# EAGLE design 3Ph RC (EAGLE 6.1)

## Sheet 1 of 2
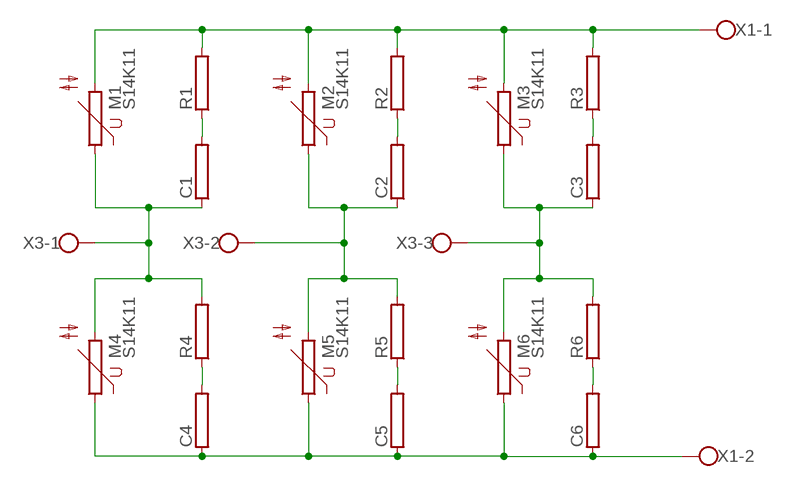
[diagram p0: schematic, sheet 1]

### Parts
C1  RRWM8X34  [RWM8X34]
C2  RRWM8X34  [RWM8X34]
C3  RRWM8X34  [RWM8X34]
C4  RRWM8X34  [RWM8X34]
C5  RRWM8X34  [RWM8X34]
C6  RRWM8X34  [RWM8X34]
M1  S14K11  [S14K11]
M2  S14K11  [S14K11]
M3  S14K11  [S14K11]
M4  S14K11  [S14K11]
M5  S14K11  [S14K11]
M6  S14K11  [S14K11]
R1  RRWM10X45  [RWM10X45]
R2  RRWM10X45  [RWM10X45]
R3  RRWM10X45  [RWM10X45]
R4  RRWM10X45  [RWM10X45]
R5  RRWM10X45  [RWM10X45]
R6  RRWM10X45  [RWM10X45]
X1  W237-102  [W237-102]
X3  W237-103  [W237-103]

### Nets
C1: C1.2 R1.1
N$2: M1.2 M2.2 M3.2 R1.2 R2.2 R3.2 X1.1
N$3: C2.1 M2.1 M5.2 R5.2 X3.2
N$4: C2.2 R2.1
N$5: C3.2 R3.1
N$6: C1.1 M1.1 M4.2 R4.2 X3.1
N$7: C3.1 M3.1 M6.2 R6.2 X3.3
N$9: C6.2 R6.1
N$10: C4.1 C5.1 C6.1 M4.1 M5.1 M6.1 X1.2
N$11: C4.2 R4.1
N$12: C5.2 R5.1

## Sheet 2 of 2

## Library data of the parts
C1-C6 R1-R6 = resistor-power:R: Power Resitor; OC_FARNELL: unknown; OC_NEWARK: unknown
M1-M6 = varistor:S14K11: VARISTOR
X1 = con-wago-500:W237-102: WAGO SCREW CLAMP; MPN: 237-102; OC_FARNELL: unknown; OC_NEWARK: 70K9898
X3 = con-wago-500:W237-103: WAGO SCREW CLAMP; MPN: 237-103; OC_FARNELL: unknown; OC_NEWARK: 18M7116

## Board
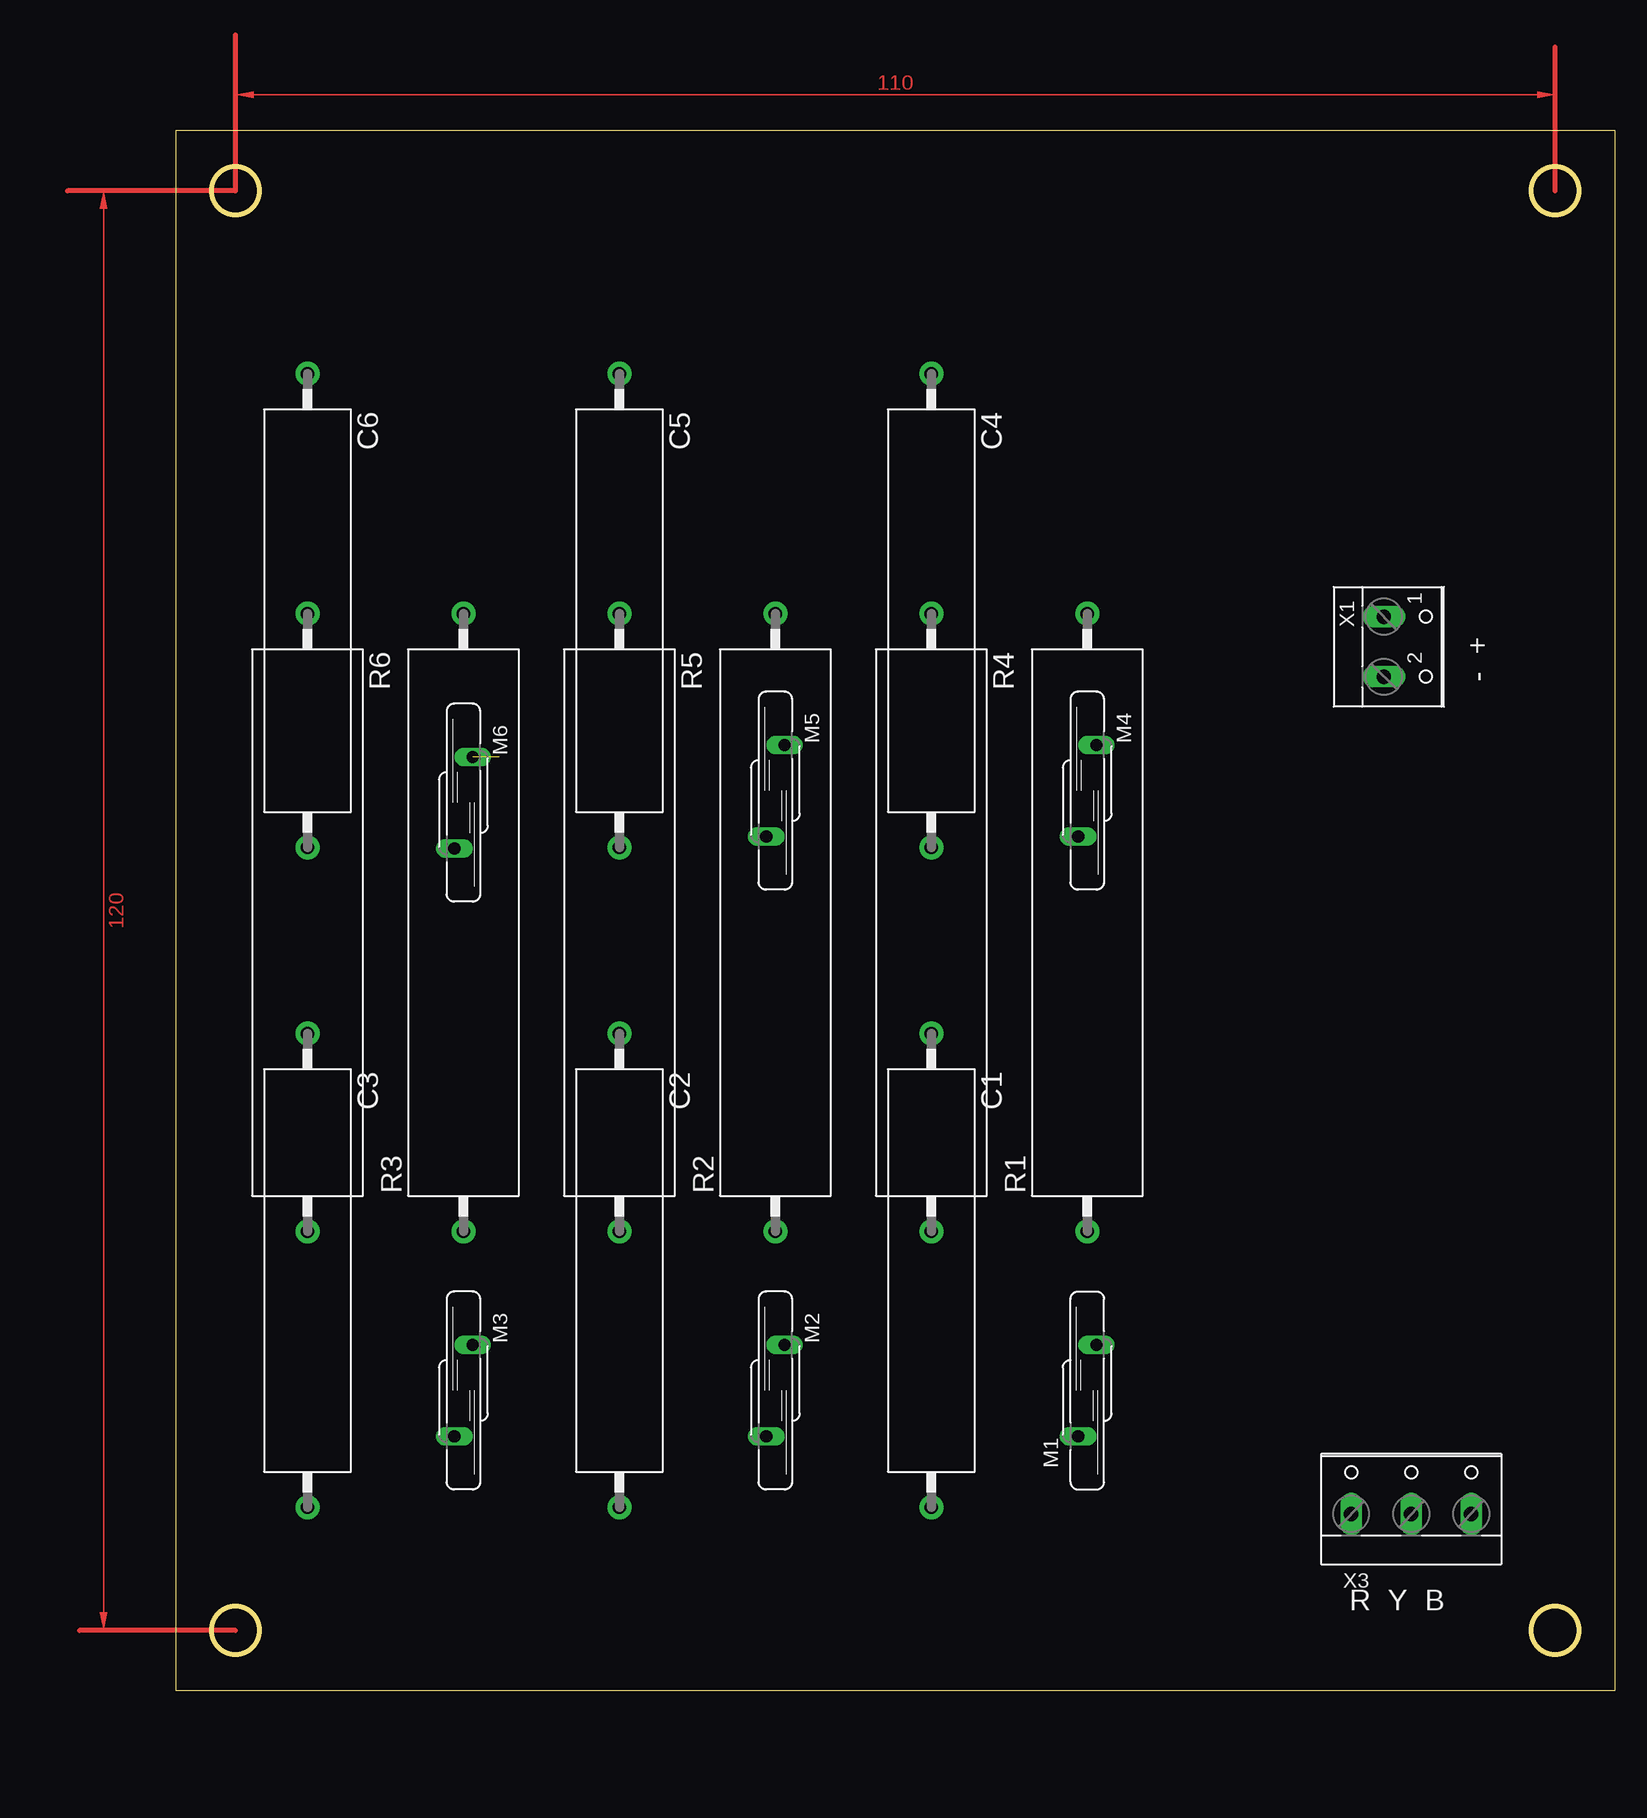
[diagram p1: board, top side]
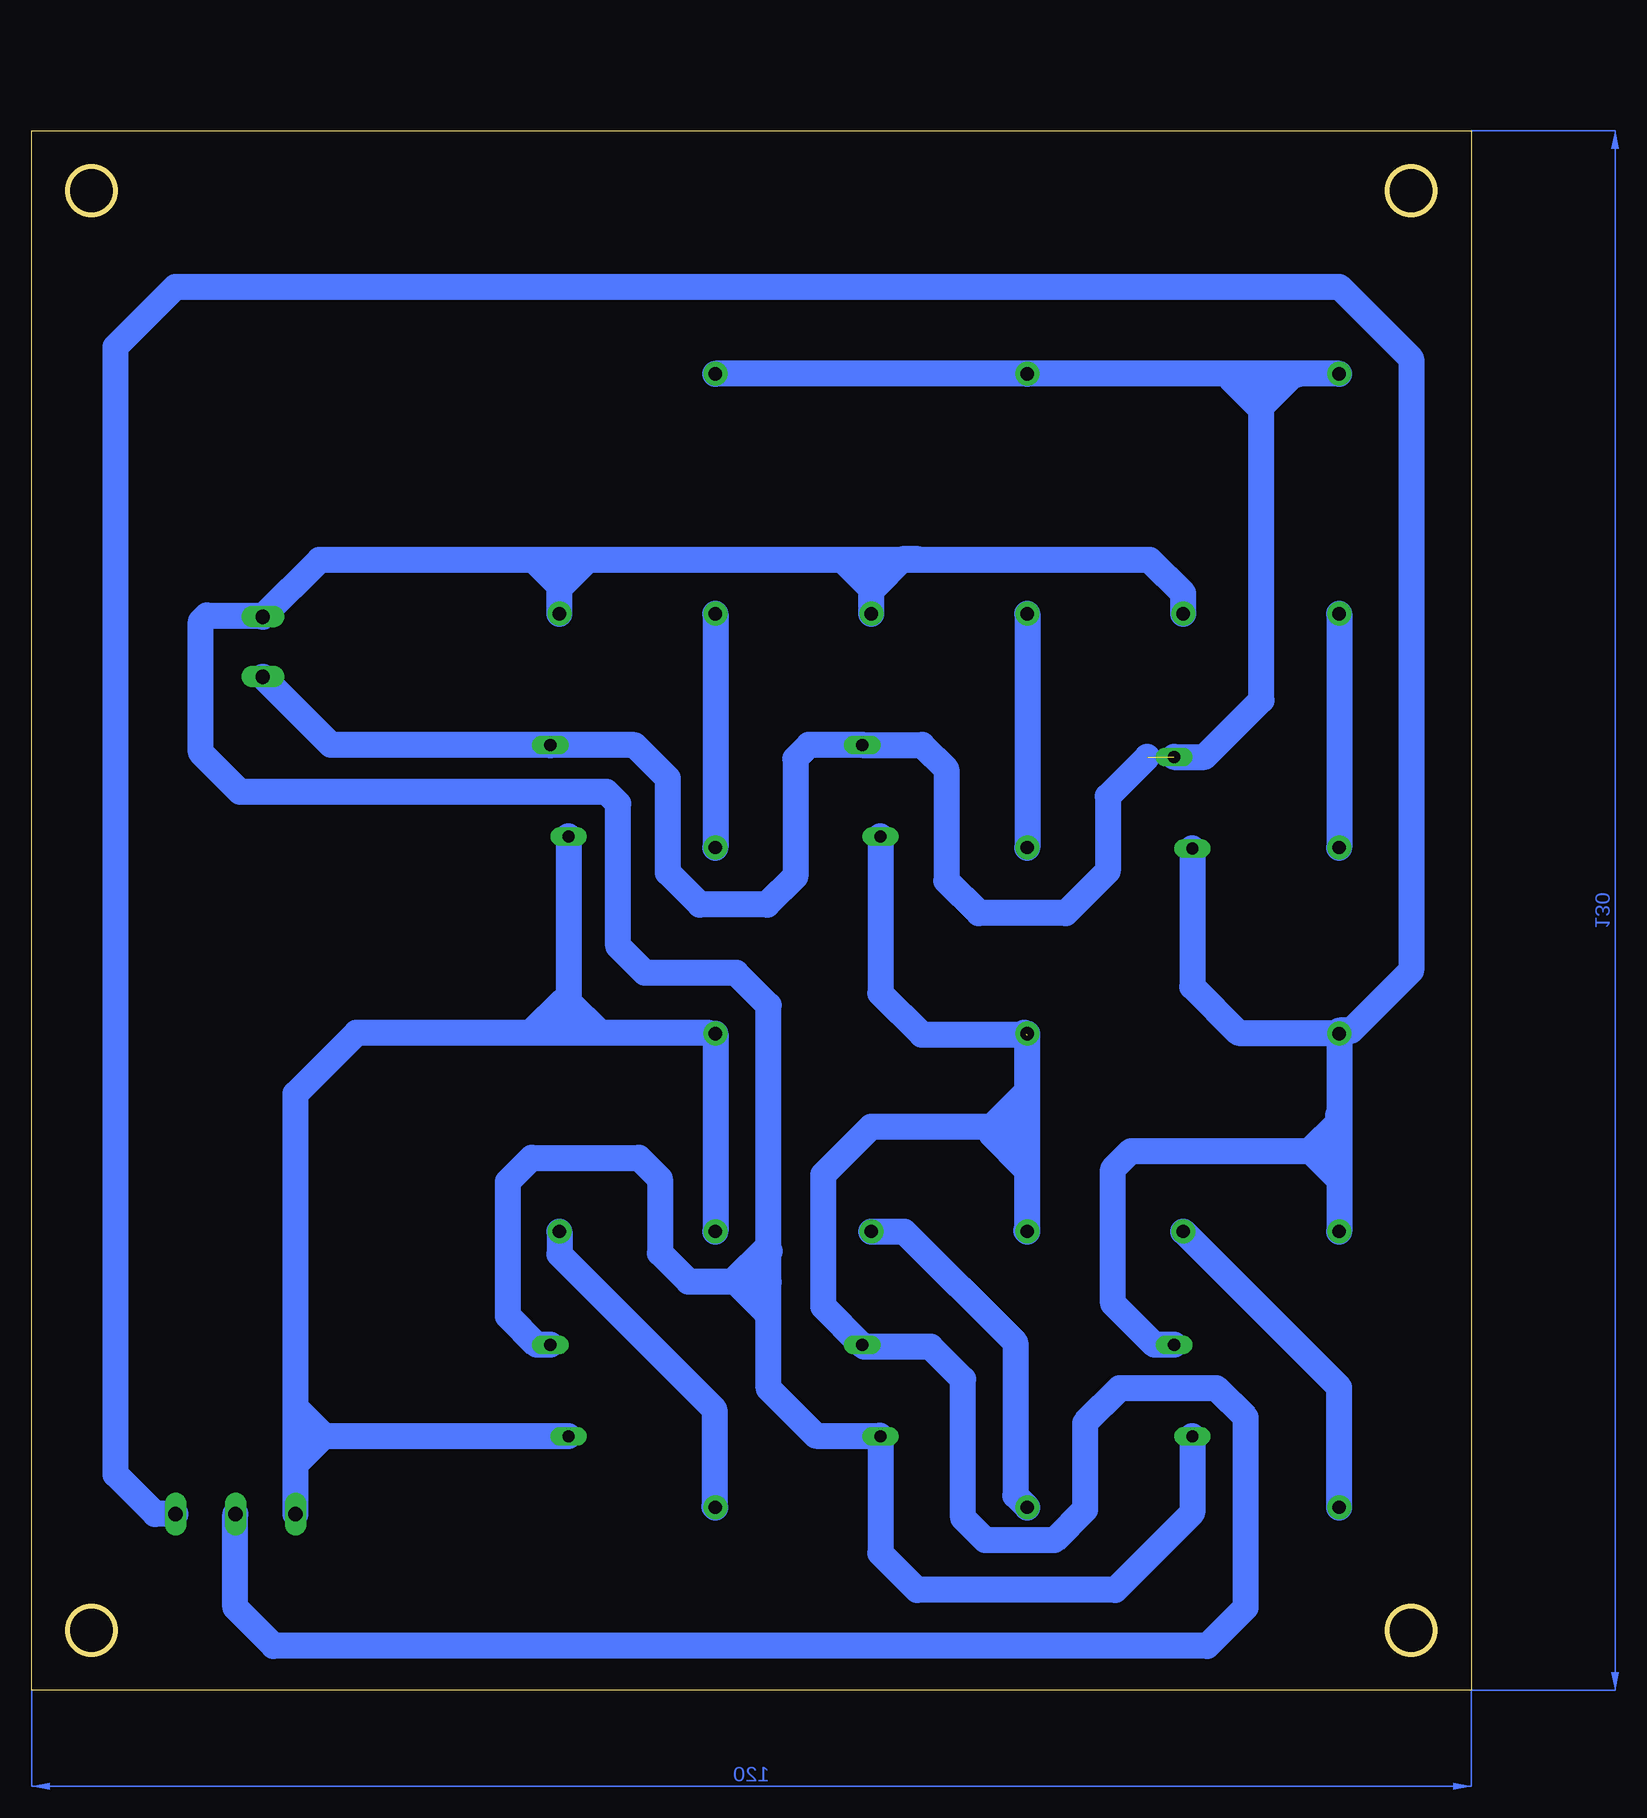
[diagram p2: board, bottom side, seen from below]

Size 120 x 130 mm. Coordinates in mm from the lower left corner, seen from the top.
Outline: 0,0 120,0 120,130 0,130 0,0
Outline: circle at 5,5 radius 2
Outline: circle at 115,5 radius 2
Outline: circle at 5,125 radius 2
Outline: circle at 115,125 radius 2
Copper layers (1*16): Top 0.035mm / dielectric 1.5mm / Bottom 0.035mm
Design rules: minimum track width 6mil, minimum drill 0.35mm, track to track 6mil, track to pad 6mil, pad to pad 6mil, via to via 6mil, smd to smd 6mil, copper to edge 40mil, drill to drill 6mil, minimum pad ring 10mil, minimum via ring 8mil, stop-mask expansion 4mil, vias tented up to drill 0mil, thermal gap 10mil

### Footprints (pad centres in the part's own frame; a part is rotated, then mirrored left to right if it is on the bottom)
RWM8X34 = drill 1.1 pad 2: 1 -19.74,0; 2 19.74,0
S14K11 = drill 1.016 long: 1 -0.762,-3.81; 2 0.762,3.81
RWM10X45 = drill 1.1 pad 2: 1 -25.74,0; 2 25.74,0
W237-102 = drill 1.194 long: 1 -2.5,-1.27; 2 2.5,-1.27
W237-103 = drill 1.194 long: 1 -5,-1.29; 2 0,-1.29; 3 5,-1.29

### Placement (x,y rotation side)
C1  63,35 270 top
C2  37,35 270 top
C3  11,35 270 top
C4  63,90 270 top
C5  37,90 270 top
C6  11,90 270 top
M1  76,25 0 top
M2  50,25 180 top
M3  24,25 180 top
M4  76,75 180 top
M5  50,75 180 top
M6  24,74 180 top
R1  76,64 90 top
R2  50,64 90 top
R3  24,64 90 top
R4  63,64 270 top
R5  37,64 270 top
R6  11,64 270 top
X1  102,87 270 top
X3  103,16 0 top

### Tracks (layer width: path | path; a pad name or v marks a point on that pad's centre or on a via)
C1
  Bottom 2.184: R1.1 76,36.35 63.07,23.42 63.07,15.33 C1.2
N$1
  Bottom 2.184: 97.94,23.67 97.94,23.55 95.58,21.18 95.63,21.18 97.84,18.97
N$2
  Bottom 2.184: R3.2 24,91.44 26.8,94.23 49.91,94.23 | 49.91,94.23 73.66,94.23 | 73.66,94.23 76.02,94.23 | 76.02,94.23 96,94.23 X1.1 100.84,89.61 105.39,89.61 105.89,89.1 105.89,78.18 102.62,74.91 72.08,74.91 71.09,73.91 71.09,62.05 68.86,59.82 61.27,59.82 58.55,57.1 58.55,34.01 | R2.2 50,94.14 49.91,94.23 | R1.2 76,94.21 76.02,94.23 | M1.2 77.88,28.81 80.29,31.22 80.29,42.42 78.31,44.4 69.37,44.4 67.61,42.65 67.61,36.45 65.25,34.09 58.62,34.09 58.55,34.01 | 58.55,34.01 58.55,25.17 54.61,21.23 49.28,21.23 M2.2 49.24,11.44 46.18,8.38 29.67,8.38 23.24,14.81 M3.2 | 73.66,94.23 75.79,92.1 76.02,92.1 77.98,94.06
N$3  (1 unrouted)
  Bottom 2.184: M5.2 49.24,58.1 45.8,54.66 37.08,54.66 C2.1 | 37.08,38.34 R5.2 37,47.65 | X3.2 103.02,14.69 103.02,6.91 99.82,3.71 22,3.71 18.8,6.91 18.8,22.76 21.23,25.2 29.29,25.2 32.18,22.3 32.18,15.09 34.75,12.52 40.49,12.52 42.34,14.38 42.34,25.93 45.06,28.65 50.6,28.65 M2.1 50.81,28.81 54,32 54,43 50,47 37.65,47 37,47.65 | 37,47.65 37,54.58 37.26,54.84
N$4
  Bottom 2.184: R2.1 47.26,38.26 38,29 38,16.26 C2.2
N$5
  Bottom 2.184: C3.2 11,25.26 R3.1
N$6
  Bottom 2.184: C1.1 63,54.2 | 63,54.2 R4.2 | M4.2 75.24,54.84 75.26,54.81 | 63,54.2 63.61,54.81 75.26,54.81 | X3.1 98,20.65 | 98,20.65 98,49.73 92.91,54.81 75.26,54.81 | M1.1 97.46,21.19 98,20.65
N$7
  Bottom 2.184: C3.1 11,44.81 | 11,44.81 R6.2 | M6.2 23.24,58.67 19.38,54.81 11.07,54.81 C3.1 | M3.1 26.4,28.81 29.84,32.26 29.84,43.46 28.35,44.96 11.79,44.96 11.63,44.81 11,44.81 | X3.3 109.71,14.71 113,18 113,112 108,117 11,117 5,111 5,60 10,55 11,55 C3.1
N$8
  Bottom 2.184: 75.13,57.23 75.01,57.23 72.9,55.12
N$9
  Bottom 2.184: R6.1 C6.2
N$10  (1 unrouted)
  Bottom 2.184: 26.99,77.81 30.28,74.52 30.28,68.3 33.78,64.8 41.05,64.8 43.74,67.49 43.74,76.78 45.77,78.81 M5.1 55.2,78.81 56.34,77.67 56.34,67.84 58.67,65.51 64.29,65.51 66.95,68.17 66.95,76.02 69.72,78.79 76.74,78.79 M4.1 95.04,78.81 X1.2 | C6.1 17.83,109.74 | 17.83,109.74 C5.1 C4.1 | M6.1 22.21,77.81 17.48,82.55 17.48,107.01 | 17.48,107.01 17.48,109.38 17.83,109.74 | 14.48,109.7 14.78,109.7 17.48,107.01 | 17.48,107.01 17.73,107.01 19.96,109.25
N$11
  Bottom 2.184: R4.1 C4.2
N$12
  Bottom 2.184: R5.1 C5.2
N$13
  Top 0.406: 115,125 115,137
N$14
  Bottom 2.184: 75.31,57.4 75.79,57.4 78.13,55.07
N$15
  Bottom 2.184: 11.07,47.93 11.07,47.32 13.39,45.01 13.39,44.96 11.07,42.65
N$16
  Bottom 2.184: 37.06,49.63 37.31,49.63 39.98,46.97 39.98,46.33 37.26,43.61
N$17
  Bottom 2.184: 58.45,36.6 59,36.6 61.24,34.37 61.24,33.96 58.83,31.55
N$18
  Bottom 2.184: 46.05,94.28 47.42,94.28 49.73,91.97 50.14,91.97 52.22,94.06
N$19
  Top 0.406: -9,125 5,125 5,138
N$20
  Top 0.406: 5,5 -8,5
(copper drawn outside any net)
  shapes: Bottom area x2, Top area x2

### Text on the board
tPlace: - + | R Y B